# EasyEDA Pro project ProPrj_13cmPA-V1_V1_2025-12-29.epro

# Schematic 13cmPA-V1_V1
Board Name: 13cmPA-V1_V1; Create Date: 2025-12-21; Page Name: 13cmPA; Project Name: 13cmPA-V1_V1; Schematic Name: 13cmPA-V1_V1; Update Date: 2025-12-21; File: 13cmPA; Id: /; Sheet: /
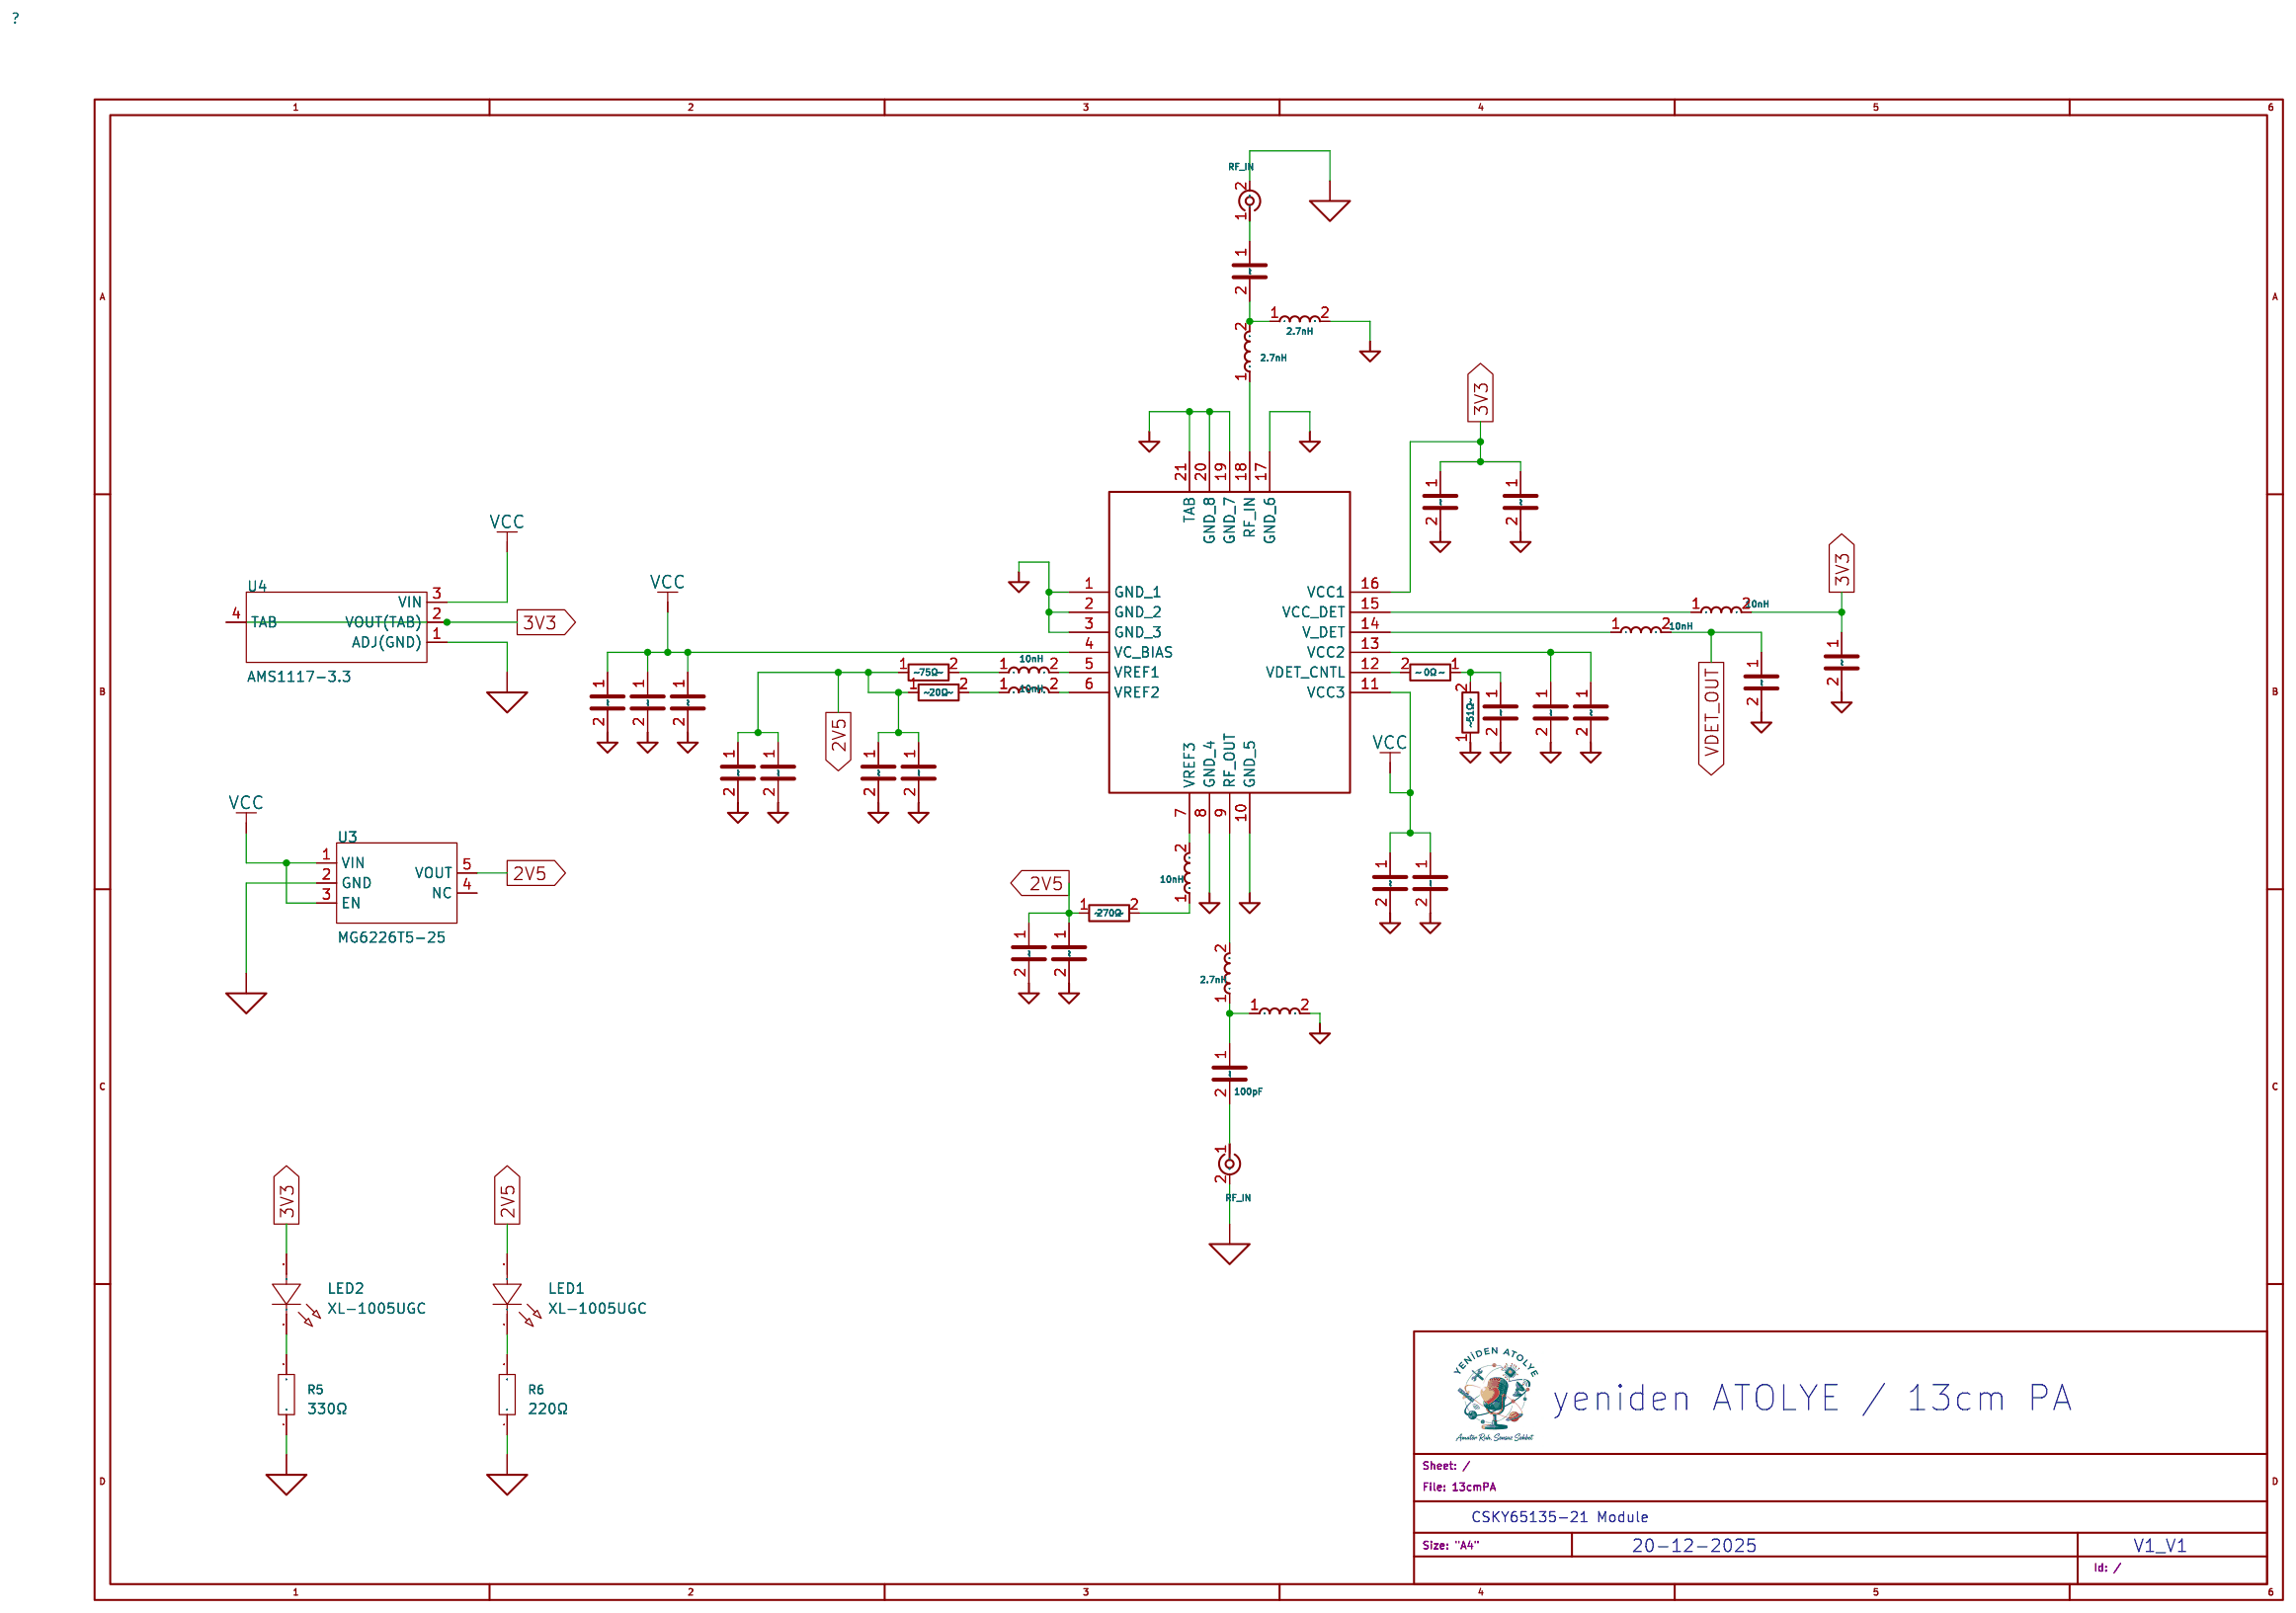
[diagram p0: schematic sheet]

## Parts
C1  8.2pF  [C0402]
C2  10uF  [C0805]
C3  100nF  [C0402]
C4  8.2pF  [C0402]
C5  100nF  [C0402]
C6  8.2pF  [C0402]
C7  10uF  [C0805]
C8  100nF  [C0402]
C9  100nF  [C0402]
C10  8.2pF  [C0402]
C11  3.3nF  [C0402]
C12  8.2pF  [C0402]
C13  8.2pF  [C0402]
C14  100nF  [C0402]
C15  270pF  [C0402]
C16  C0402A101J500NT  [C0402]
C17  10uF  [C0805]
C18  100pF  [C0805]
C19  100pF  [C0805]
C20  100nF  [C0402]
IC1  SKY65135-21  [QFN100P600X600X155-21M]
J1  RF_IN  [Connector_Coaxial:SMA_Amphenol_132289_EdgeMount]
J2  RF_IN  [Connector_Coaxial:SMA_Amphenol_132289_EdgeMount]
L1  10nH  [L0402-RD]
L2  10nH  [L0402-RD]
L3  2.7nH  [L0402-RD]
L4  2.7nH  [L0402-RD]
L5  2.7nH  [L0402-RD]
L6  2.7nH  [L0402-RD]
L7  10nH  [L0402-RD]
L8  10nH  [L0402-RD]
L9  10nH  [L0402-RD]
LED1  XL-1005UGC  [LED0402-RD_GREEN]
LED2  XL-1005UGC  [LED0402-RD_GREEN]
R1  75Ω  [R0402]
R2  20Ω  [R0402]
R3  0Ω  [R0402]
R4  51Ω  [R0402]
R5  330Ω  [R0402]
R6  220Ω  [R0402]
R7  270Ω  [R0402]
U3  MG6226T5-25  [SOT-23-5_L2.9-W1.6-P0.95-LS2.8-BL]
U4  AMS1117-3.3  [SOT-223-4_L6.5-W3.5-P2.30-LS7.0-BR]

## Library data of the parts
C1 C4 C6 C10 C12 C13 = 0402CG8R2C500NT: Capacitance:8.2pF Voltage Rating:50V Temperature Coefficient:C0G; LCSC Part Name: ±0.25pF 8.2pF 50V; Supplier Part: C1579; Manufacturer: FH(风华); Supplier Footprint: 0402; JLCPCB Part Class: Extended Part; Datasheet: https://item.szlcsc.com/datasheet/0402CG8R2C500NT/1931.html; Supplier: LCSC; Voltage Rating: 50V; Temperature Coefficient: C0G
C2 C7 C17 = C0805X106K010T: Capacitance:10uF Tolerance:±10% Tolerance:±10% Voltage Rating:10V Temperature Coefficient:X7R; LCSC Part Name: 10uF ±10% 10V; Supplier Part: C340314; Manufacturer: IHHEC(禾伸堂); Supplier Footprint: 0805; JLCPCB Part Class: Extended Part; Datasheet: https://item.szlcsc.com/datasheet/C0805X106K010T/317654.html; Supplier: LCSC; Tolerance: ±10%; Voltage Rating: 10V; Temperature Coefficient: X7R
C3 C5 C8 C9 C14 C20 = C0402X104K050T: Capacitance:100nF Tolerance:±10% Tolerance:±10% Voltage Rating:50V Temperature Coefficient:X7R; LCSC Part Name: 100nF ±10% 50V; Supplier Part: C501838; Manufacturer: IHHEC(禾伸堂); Supplier Footprint: 0402; JLCPCB Part Class: Extended Part; Datasheet: https://item.szlcsc.com/datasheet/C0402X104K050T/514597.html; Supplier: LCSC; Tolerance: ±10%; Voltage Rating: 50V; Temperature Coefficient: X7R
C11 = CC0402KRX7R9BB332: Capacitance:3.3nF Tolerance:±10% Tolerance:±10% Voltage Rating:50V Temperature Coefficient:X7R; LCSC Part Name: 3.3nF ±10% 50V; Supplier Part: C107028; Manufacturer: YAGEO(国巨); Supplier Footprint: 0402; JLCPCB Part Class: Extended Part; Datasheet: https://item.szlcsc.com/datasheet/CC0402KRX7R9BB332/108244.html; Supplier: LCSC; Tolerance: ±10%; Voltage Rating: 50V; Temperature Coefficient: X7R
C15 = CC0402KRX7R9BB271: Capacitance:270pF Tolerance:±10% Tolerance:±10% Voltage Rating:50V Temperature Coefficient:X7R; LCSC Part Name: 270pF ±10% 50V; Supplier Part: C107027; Manufacturer: YAGEO(国巨); Supplier Footprint: 0402; JLCPCB Part Class: Extended Part; Datasheet: https://item.szlcsc.com/datasheet/CC0402KRX7R9BB271/108243.html; Supplier: LCSC; Tolerance: ±10%; Voltage Rating: 50V; Temperature Coefficient: X7R
C16 = C0402A101J500NT: Supplier Part: C17702724; Manufacturer: TORCH(火炬); Supplier Footprint: 0402; JLCPCB Part Class: Extended Part; Datasheet: https://atta.szlcsc.com/upload/public/pdf/source/20230927/0E50D64F4D2F311F509CBC9B8B2C0B7B.pdf; Supplier: LCSC
C18 C19 = CL21C101JBANNNC: Capacitance:100pF Tolerance:±5% Tolerance:±5% Voltage Rating:50V Temperature Coefficient:C0G; LCSC Part Name: 100pF ±5% 50V; Supplier Part: C1790; Manufacturer: SAMSUNG(三星); Supplier Footprint: 0805; JLCPCB Part Class: Basic Part; Datasheet: https://item.szlcsc.com/datasheet/CL21C101JBANNNC/2142.html; Supplier: LCSC; Tolerance: ±5%; Voltage Rating: 50V; Temperature Coefficient: C0G
IC1 = SKY65135-21
J1 = Connector_Conn_Coaxial_Small: small coaxial connector (BNC, SMA, SMB, SMC, Cinch/RCA, LEMO, ...)
J2 = Connector_Conn_Coaxial_Small: small coaxial connector (BNC, SMA, SMB, SMC, Cinch/RCA, LEMO, ...); Attribute1: J1
L1 L2 L7-L9 = LQG15HS10NJ02D: Inductance:10nH Tolerance:±5% Tolerance:±5% Current Rating:500mA Current - Saturation (Isat):- DC Resistance(DCR):260mΩ Q @ Frequency:8@100MHz Frequency - Self Resonant:3.4GHz Ratings:-; LCSC Part Name: 10nH ±5%; Supplier Part: C77103; Manufacturer: muRata(村田); Supplier Footprint: 0402; JLCPCB Part Class: Extended Part; Datasheet: https://item.szlcsc.com/datasheet/LQG15HS10NJ02D/78230.html; Supplier: LCSC; Tolerance: ±5%; Current Rating: 500mA; DC Resistance(DCR): 260mΩ; Q @ Frequency: 8@100MHz; Frequency - Self Resonant: 3.4GHz
L3-L6 = MLG1005S2N7BT000: Inductance:2.7nH Tolerance:- Tolerance:- Current Rating:800mA Current - Saturation (Isat):- DC Resistance(DCR):80mΩ Q @ Frequency:7@100MHz Frequency - Self Resonant:6GHz Ratings:-; LCSC Part Name: ±0.1nH 2.7nH; Supplier Part: C275282; Manufacturer: TDK; Supplier Footprint: 0402; JLCPCB Part Class: Extended Part; Datasheet: https://item.szlcsc.com/datasheet/MLG1005S2N7BT000/263369.html; Supplier: LCSC; Current Rating: 800mA; DC Resistance(DCR): 80mΩ; Q @ Frequency: 7@100MHz; Frequency - Self Resonant: 6GHz
LED1 LED2 = XL-1005UGC_C965793: Illumination Color:Emerald Green Voltage - Forward(Vf):3V Voltage - Forward(Vf):3V Power(Watts):80mW Forward Current:25mA Wavelength - Dominant:516nm~531nm Wavelength - Dominant:516nm~531nm Peak Wavelength:531nm Lens Color:Water Clear Color Temperature:-; LCSC Part Name: 0402翠绿贴片式发光二极管; Supplier Part: C965793; Manufacturer: XINGLIGHT(成兴光); Supplier Footprint: 0402; JLCPCB Part Class: Extended Part; Datasheet: https://item.szlcsc.com/datasheet/XL-1005UGC/1051402.html; Supplier: LCSC; Illumination Color: Emerald Green; Voltage - Forward(Vf): 3V; Power(Watts): 80mW; Forward Current: 25mA; Wavelength - Dominant: 516nm~531nm; Peak Wavelength: 531nm; Lens Color: Water Clear; Luminous Intensity: 249mcd; Viewing Angle: 120°; Mounting Style: op View Mount; Operating Temperature: -40℃~+85℃
R1 = CR0402FF75R0G: Type:Thick Film Resistors Resistance: Tolerance:±1% Tolerance:±1% Power(Watts): Overload Voltage (Max): Temperature Coefficient:±200ppm/℃ Temperature Coefficient:±200ppm/℃ Operating Temperature Range:-55℃~+125℃ Operating Temperature Range:-55℃~+125℃; LCSC Part Name: 厚膜电阻 75Ω ±1% 62.5mW; Supplier Part: C100528; Manufacturer: LIZ(丽智电子); Supplier Footprint: 0402; JLCPCB Part Class: Extended Part; Datasheet: https://atta.szlcsc.com/upload/public/pdf/source/20180403/C189438_6D658388CC7843F35BBC9018D03F0B8E.pdf; Supplier: LCSC; Type: Thick Film Resistors; Tolerance: ±1%; Temperature Coefficient: ±200ppm/℃; Operating Temperature Range: -55℃~+125℃
R2 = CR0402FF20R0G: Type:Thick Film Resistors Resistance: Tolerance:±1% Tolerance:±1% Power(Watts): Overload Voltage (Max): Temperature Coefficient:±200ppm/℃ Temperature Coefficient:±200ppm/℃ Operating Temperature Range:-55℃~+125℃ Operating Temperature Range:-55℃~+125℃; LCSC Part Name: 厚膜电阻 20Ω ±1% 62.5mW; Supplier Part: C100299; Manufacturer: LIZ(丽智电子); Supplier Footprint: 0402; JLCPCB Part Class: Extended Part; Datasheet: https://atta.szlcsc.com/upload/public/pdf/source/20180403/C189438_6D658388CC7843F35BBC9018D03F0B8E.pdf; Supplier: LCSC; Type: Thick Film Resistors; Tolerance: ±1%; Temperature Coefficient: ±200ppm/℃; Operating Temperature Range: -55℃~+125℃
R3 = SCR0402J0R: Type:Thick Film Resistor Resistance:0Ω Tolerance:±5% Tolerance:±5% Power(Watts):62.5mW Voltage-Supply(Max):50V Operating Temperature:-55℃~+155℃ Operating Temperature:-55℃~+155℃; LCSC Part Name: 厚膜电阻 0Ω ±5% 62.5mW; Supplier Part: C3017451; Manufacturer: VO(翔胜); Supplier Footprint: 0402; JLCPCB Part Class: Extended Part; Datasheet: https://atta.szlcsc.com/upload/public/pdf/source/20220513/247AF9639BA21CF93567DC289CCC6A22.pdf; Supplier: LCSC; Type: Thick Film Resistor; Tolerance: ±5%; Power(Watts): 62.5mW; Voltage-Supply(Max): 50V; Operating Temperature: -55℃~+155℃
R4 = RC0402FR-0751RL: Type:Thick Film Resistor Resistance:51Ω Tolerance:±1% Tolerance:±1% Power(Watts):62.5mW Voltage-Supply(Max):50V Temperature Coefficient:±100ppm/℃ Temperature Coefficient:±100ppm/℃ Operating Temperature:-55℃~+155℃ Operating Temperature:-55℃~+155℃; LCSC Part Name: 厚膜电阻 51Ω ±1% 62.5mW; Supplier Part: C137960; Manufacturer: YAGEO(国巨); Supplier Footprint: 0402; JLCPCB Part Class: Extended Part; Datasheet: https://item.szlcsc.com/datasheet/RC0402FR-0751RL/149276.html; Supplier: LCSC; Type: Thick Film Resistor; Tolerance: ±1%; Power(Watts): 62.5mW; Voltage-Supply(Max): 50V; Temperature Coefficient: ±100ppm/℃; Operating Temperature: -55℃~+155℃
R5 = 0402WGF3300TCE: Type:Thick Film Resistors Resistance:330Ω Tolerance:±1% Tolerance:±1% Power(Watts):1/16W Voltage-Supply(Max):50V Temperature Coefficient:±100ppm/℃ Temperature Coefficient:±100ppm/℃ Operating Temperature:-55℃~+155℃ Operating Temperature:-55℃~+155℃; LCSC Part Name: 330Ω ±1% 62.5mW 厚膜电阻; Supplier Part: C25104; Manufacturer: UNI-ROYAL(厚声); Supplier Footprint: 0402; JLCPCB Part Class: Basic Part; Datasheet: https://item.szlcsc.com/datasheet/0402WGF3300TCE/25847.html; Supplier: LCSC; Type: Thick Film Resistors; Tolerance: ±1%; Power(Watts): 1/16W; Voltage-Supply(Max): 50V; Temperature Coefficient: ±100ppm/℃; Operating Temperature: -55℃~+155℃
R6 = 0402WGF2200TCE: Type:Thick Film Resistor Resistance:220Ω Tolerance:±1% Tolerance:±1% Power(Watts):62.5mW Voltage-Supply(Max):50V Temperature Coefficient:±100ppm/℃ Temperature Coefficient:±100ppm/℃ Operating Temperature:-55℃~+155℃ Operating Temperature:-55℃~+155℃; LCSC Part Name: 220Ω ±1% 62.5mW 厚膜电阻; Supplier Part: C25091; Manufacturer: UNI-ROYAL(厚声); Supplier Footprint: 0402; JLCPCB Part Class: Basic Part; Datasheet: https://item.szlcsc.com/datasheet/0402WGF2200TCE/25834.html; Supplier: LCSC; Type: Thick Film Resistor; Tolerance: ±1%; Power(Watts): 62.5mW; Voltage-Supply(Max): 50V; Temperature Coefficient: ±100ppm/℃; Operating Temperature: -55℃~+155℃
R7 = CR0402JF0271G: Type:Thick Film Resistors Resistance: Tolerance:±5% Tolerance:±5% Power(Watts): Overload Voltage (Max): Temperature Coefficient:±200ppm/℃ Temperature Coefficient:±200ppm/℃ Operating Temperature Range:-55℃~+125℃ Operating Temperature Range:-55℃~+125℃; LCSC Part Name: 厚膜电阻 270Ω ±5% 62.5mW; Supplier Part: C100627; Manufacturer: LIZ(丽智电子); Supplier Footprint: 0402; JLCPCB Part Class: Extended Part; Datasheet: https://atta.szlcsc.com/upload/public/pdf/source/20180403/C189438_6D658388CC7843F35BBC9018D03F0B8E.pdf; Supplier: LCSC; Type: Thick Film Resistors; Tolerance: ±5%; Temperature Coefficient: ±200ppm/℃; Operating Temperature Range: -55℃~+125℃
U3 = MG6226T5-25: Output Type:Fixed Voltage - Supply:5.5V Output Voltage:2.5V Output Voltage:2.5V Output Current:300mA Power Supply Rejection Ratio (PSRR):45dB@(1kHz) Voltage Dropout:500mV@(300mA) standby current:500nA Features:Over Current Protection；Short Circuit Protect; LCSC Part Name: 输入5.5V 输出2.5V 300mA; Supplier Part: C42411002; Manufacturer: Megain(美佳音); Supplier Footprint: SOT-23-5; Datasheet: https://item.szlcsc.com/datasheet/MG6226T5-25/44391804.html; Supplier: LCSC; Output Type: Fixed; Voltage - Supply: 5.5V; Output Voltage: 2.5V; Output Current: 300mA; Power Supply Rejection Ratio (PSRR): 45dB@(1kHz); Voltage Dropout: 500mV@(300mA); standby current: 500nA; Features: Over Current Protection；Short Circuit Protection；Thermal Shutdown; Operating Temperature: -40℃~+85℃@(Ta); Output Configuration: Positive; Number of Outputs: 1
U4 = AMS1117-3.3_C347222: Output Type:Fixed Voltage - Supply:12V Output Voltage:3.3V Output Voltage:3.3V Output Current:1A Power Supply Rejection Ratio (PSRR):60dB@(120Hz) Voltage Dropout:1.3V@(1A) standby current:5mA Noise:0.003%Vout Features:Over Current Protection Operating Tem; LCSC Part Name: 输出:3.3V 电流:1A 耐压:12V; Supplier Part: C347222; Manufacturer: UMW(友台半导体); Supplier Footprint: SOT-223; JLCPCB Part Class: Extended Part; Datasheet: https://item.szlcsc.com/datasheet/AMS1117-3.3/323882.html; Supplier: LCSC; Output Type: Fixed; Voltage - Supply: 12V; Output Voltage: 3.3V; Output Current: 1A; Power Supply Rejection Ratio (PSRR): 60dB@(120Hz); Voltage Dropout: 1.3V@(1A); standby current: 5mA; Noise: 0.003%Vout; Features: Over Current Protection; Operating Temperature: -40℃~+125℃; Output Configuration: Positive; Number of Outputs: 1

## Nets
2V5: C3.1 C4.1 C5.1 C6.1 C9.1 C10.1 LED1.2(A) R1.1 R2.1 R7.1 U3.5(VOUT)
3V3: C7.1 C8.1 C11.1 IC1.16(VCC1) L1.2 LED2.2(A) U4.2(VOUT(TAB)) U4.4(TAB)
GND: C1.2 C2.2 C3.2 C4.2 C5.2 C6.2 C7.2 C8.2 C9.2 C10.2 C11.2 C12.2 C13.2 C14.2 C15.2 C16.2 C17.2 C20.2 IC1.1(GND) IC1.2(GND) IC1.3(GND) IC1.8(GND_4) IC1.10(GND_5) IC1.17(GND_6) IC1.19(GND_7) IC1.20(GND_8) IC1.21(TAB) J1.2(Ext) J2.2(Ext) L4.2 L6.2 R4.1 R5.1 R6.1 U3.2(GND) U4.1(ADJ(GND))
VCC: C1.1 C2.1 C16.1 C17.1 C20.1 IC1.4(VC_BIAS) IC1.11(VCC3) U3.1(VIN) U3.3(EN) U4.3(VIN)
VDET_OUT: C12.1 L2.2
$1N4: C13.1 C14.1 IC1.13(VCC2)
$1N6: C15.1 R3.1 R4.2
$1N16: IC1.15(VCC_DET) L1.1
$1N17: IC1.12(VDET_CNTL) R3.2
$1N24: IC1.14(V_DET) L2.1
$1N3967: LED2.1(K) R5.2
$1N3984: LED1.1(K) R6.2
$1N4045: IC1.18(RF_IN) L3.1
$1N4072: C18.2 L3.2 L4.1
$1N4155: C19.1 L5.1 L6.1
$1N4158: IC1.9(RF_OUT) L5.2
$1N7293: IC1.7(VREF3) L7.2
$1N7297: L7.1 R7.2
$1N7421: IC1.6(VREF2) L9.2
$1N7425: IC1.5(VREF1) L8.2
$1N7430: L8.1 R1.2
$1N7435: L9.1 R2.2
Net-(C18-1): C18.1 J1.1(In)
Net-(C19-2): C19.2 J2.1(In)

Not connected (* = marked no-connect by the designer): U3 4(NC)

## Notes on the sheet
- yeniden ATOLYE / 13cm PA
- CSKY65135-21 Module
- 20-12-2025
- V1_V1

# Board 13cmPA-V1_V1
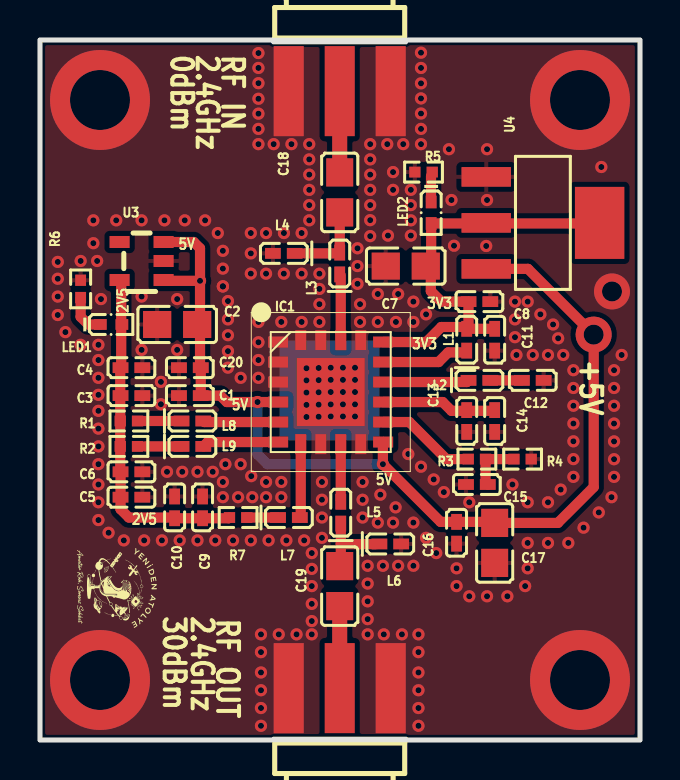
[diagram p1: board, top side]
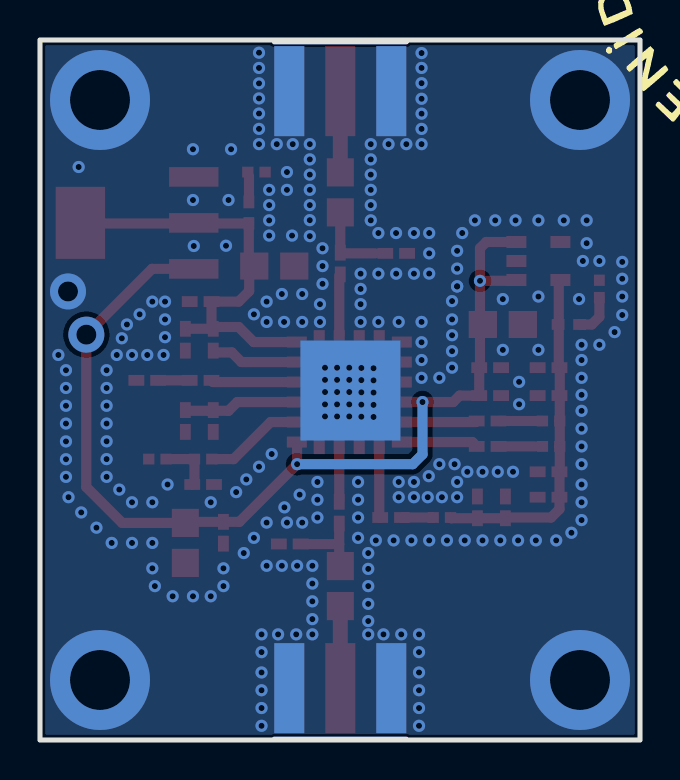
[diagram p2: board, bottom side, seen from below]

Outline 30 x 35 mm; copper layers: Top Layer, Bottom Layer. Coordinates in mm from the lower left corner of the outline.
Outline path: rectangle 0,35 30,0
Stack: Top Layer 0.035mm / Dielectric1 1.51mm FR4 er 4.5 / Bottom Layer 0.035mm

## Design rules (mm)
spacing safeClearance (default): track to track 0, other pairs 0 to 0.5
track width trackWidth (default): min 0.127, default 0.254, max 2.54
differential pair differentialPair (default): width min 0.127, default 0.254, max 2.54; gap min 0.152, default 0.152
via viaSize (default): diameter min 0.5, default 0.61, max 10; hole min 0.3, default 0.305, max 6

## Placement (name value [footprint] x y rotation side)
C1  8.2pF  [C0402]  7.49 17.22 180 top
C2  10uF  [C0805]  6.86 20.78 180 top
C3  100nF  [C0402]  4.57 17.22 0 top
C4  8.2pF  [C0402]  4.57 18.62 0 top
C5  100nF  [C0402]  4.57 12.14 0 top
C6  8.2pF  [C0402]  4.57 13.41 0 top
C7  10uF  [C0805]  18.29 23.7 180 top
C8  100nF  [C0402]  21.97 21.92 0 top
C9  100nF  [C0402]  8.13 11.63 90 top
C10  8.2pF  [C0402]  6.73 11.63 90 top
C11  3.3nF  [C0402]  22.73 20.01 270 top
C12  8.2pF  [C0402]  24.64 17.98 0 top
C13  8.2pF  [C0402]  21.34 15.95 270 top
C14  100nF  [C0402]  22.73 15.95 270 top
C15  270pF  [C0402]  21.84 12.78 180 top
C16  C0402A101J500NT  [C0402]  20.83 10.36 270 top
C17  10uF  [C0805]  22.73 9.85 270 top
C18  100pF  [C0805]  14.99 27.38 270 top
C19  100pF  [C0805]  14.99 7.7 270 top
C20  100nF  [C0402]  7.49 18.62 180 top
IC1  SKY65135-21  [QFN100P600X600X155-21M]  14.54 17.4 0 top
L1  10nH  [L0402-RD]  21.34 20.01 90 top
L2  10nH  [L0402-RD]  21.97 17.98 0 top
L3  2.7nH  [L0402-RD]  14.99 23.82 90 top
L4  2.7nH  [L0402-RD]  12.19 24.33 180 top
L5  2.7nH  [L0402-RD]  15.04 11.37 90 top
L6  2.7nH  [L0402-RD]  17.51 9.8 0 top
L7  10nH  [L0402-RD]  12.45 11.12 0 top
L8  10nH  [L0402-RD]  7.62 15.95 0 top
L9  10nH  [L0402-RD]  7.62 14.68 0 top
LED1  XL-1005UGC  [LED0402-RD_GREEN]  3.56 20.78 0 top
LED2  XL-1005UGC  [LED0402-RD_GREEN]  19.56 26.36 270 top
NOREF  -  [Pad_e1503]  14.48 17.47 90 top
R1  75Ω  [R0402]  4.45 15.95 0 top
R2  20Ω  [R0402]  4.45 14.68 0 top
R3  0Ω  [R0402]  21.84 14.05 180 top
R4  51Ω  [R0402]  24.13 14.05 180 top
R5  330Ω  [R0402]  19.18 28.4 0 top
R6  220Ω  [R0402]  2.03 22.55 270 top
R7  270Ω  [R0402]  9.91 11.12 0 top
SMA?  -  [SMA-SMD_BWSMA-KE-P001]  14.99 2.74 270 top
SMA?#2  -  [SMA-SMD_BWSMA-KE-P001#2]  14.99 32.21 90 top
U3  MG6226T5-25  [SOT-23-5_L2.9-W1.6-P0.95-LS2.8-BL]  5.08 23.95 90 top
U4  AMS1117-3.3  [SOT-223-4_L6.5-W3.5-P2.30-LS7.0-BR]  25.15 25.86 180 top

## Footprints (pads in the part's own frame, mm; a bottom-side part is the same pattern mirrored in y, then rotated)
C0402
  rect 0.79x0.54 smd: 1(-0.545,0) 2(0.545,0)
C0805
  rect 1.41x1.35 smd: 1(-1,0) 2(1,0)
L0402-RD
  rect 0.79x0.54 smd: 1(-0.545,0) 2(0.545,0)
LED0402-RD_GREEN
  rect 0.636x0.54 smd: 1(-0.538,0) 2(0.538,0)
Pad_e1503
  rect 5x5 smd far side: 1(0,0)
QFN100P600X600X155-21M
  rect 1x0.55 smd: 1(-2.63,2.5) 2(-2.63,1.5) 3(-2.63,0.5) 4(-2.63,-0.5) 5(-2.63,-1.5) 6(-2.63,-2.5) 11(2.62,-2.5) 12(2.62,-1.5) 13(2.62,-0.5) 14(2.62,0.5) 15(2.62,1.5) 16(2.62,2.5)
  rect 0.55x1 smd: 7(-1.5,-2.605) 8(-0.5,-2.605) 9(0.5,-2.605) 10(1.5,-2.605) 17(1.5,2.595) 18(0.5,2.595) 19(-0.5,2.595) 20(-1.5,2.595)
  rect 3.4x3.4 smd: 21(0,0)
R0402
  rect 0.566x0.54 smd: 1(-0.433,0) 2(0.433,0)
SMA-SMD_BWSMA-KE-P001
  rect 4.5x1.5 smd: 1(0.149,-2.55) 2(0.149,2.55) 5(0.149,0)
  rect 4.5x1.5 smd far side: 3(0.149,2.55) 4(0.149,-2.55)
SMA-SMD_BWSMA-KE-P001#2
  rect 4.5x1.5 smd: 1(0.237,-2.55) 2(0.237,2.55) 5(0.237,0)
  rect 4.5x1.5 smd far side: 3(0.237,2.55) 4(0.237,-2.55)
SOT-23-5_L2.9-W1.6-P0.95-LS2.8-BL
  rect 0.6x1 smd: 1(-0.95,-1.1) 2(0,-1.1) 3(0.95,-1.1) 4(0.95,1.1) 5(-0.95,1.1)
SOT-223-4_L6.5-W3.5-P2.30-LS7.0-BR
  rect 2.47x0.98 smd: 1(2.835,-2.3) 2(2.835,0) 3(2.835,2.3)
  rect 2.47x3.6 smd: 4(-2.835,0)

## Nets
As in the schematic, except:
GND: C1.2 C2.2 C3.2 C4.2 C5.2 C6.2 C7.2 C8.2 C9.2 C10.2 C11.2 C12.2 C13.2 C14.2 C15.2 C16.2 C17.2 C20.2 IC1.1 IC1.2 IC1.3 IC1.8 IC1.10 IC1.17 IC1.19 IC1.20 IC1.21 L4.2 L6.2 NOREF.1 R4.1 R5.1 R6.1 SMA?.1 SMA?.2 SMA?.3 SMA?.4 SMA?#2.1 SMA?#2.2 SMA?#2.3 SMA?#2.4 U3.2 U4.1
$1N4242: C19.2 SMA?.5

Pads without a net: SMA?#2 5; U3 4

## Via types
v1: diameter 1.8, hole 1, Top Layer to Bottom Layer, 2 vias
v2: diameter 0.61, hole 0.305, Top Layer to Bottom Layer, 267 vias
v3: diameter 5, hole 3, Top Layer to Bottom Layer, 4 vias

## Routing (per net, layer and track width the routed paths; a pad name or vN(x,y) marks a point on that pad's centre or on a via; arc(x,y) is an arc through that point)
2V5: length 16.8
  Top Layer w0.508: 6.73,11.12 4.45,11.12 4.03,11.54 4.03,11.89 ; C10.1 C9.1 9.44,11.09 R7.1 ; 4.06,22.91 4.06,18.78 4.01,18.73 4.01,13.42 C6.1 C5.1
3V3: length 21.2
  Top Layer w0.508: L1.2 C11.1 ; IC1.16 19.31,19.9 20.07,20.65 21.43,20.65 C8.1 20.07,21.92 19.54,22.44 19.54,24.2 19.56,24.22 LED2.2 27.7,25.83 27.73,25.86 U4.4
GND:
  vias: v1(28.6,22.43) v2(0.89,23.9) v2(0.89,23.06) v2(0.89,22.17) v2(0.89,21.25) v2(1.27,20.4) v2(2.03,23.95) v2(2.03,19.76) v2(2.67,25.98) v2(2.67,24.84) v2(2.86,23.95) v2(2.92,19.76) v2(2.92,19) v2(2.92,18.11) v2(2.92,17.26) v2(2.92,16.46) v2(2.92,15.57) v2(2.92,14.68) v2(2.92,13.79) v2(2.92,12.78) v2(2.92,11.89) v2(2.92,11) v2(3.05,22.05) v2(3.43,10.36) v2(3.81,25.98) v2(4.19,9.98) v2(5.08,25.98) v2(5.08,22.17) v2(5.08,19.51) v2(5.21,9.98) v2(6.05,17.91) v2(6.05,16.79) v2(6.1,9.98) v2(6.22,25.98) v2(6.35,13.41) v2(6.86,22.05) v2(6.86,19.51) v2(6.99,9.98) v2(7.11,13.41) v2(7.24,25.98) v2(7.87,13.41) v2(7.87,9.98) v2(8.26,25.98) v2(8.64,13.41) v2(8.76,9.98) v2(8.89,25.35) v2(9.14,24.46) v2(9.14,23.57) v2(9.14,22.68) v2(9.14,22.68) v2(9.14,12.9) v2(9.14,12.14) v2(9.27,13.79) v2(9.4,21.95) v2(9.4,21.03) v2(9.4,20.24) v2(9.4,19.44) v2(9.4,18.62) v2(9.65,9.98) v2(9.91,12.14) v2(10.03,18.11) v2(10.03,13.79) v2(10.54,25.35) v2(10.54,24.33) v2(10.54,23.32) v2(10.54,9.98) v2(10.56,13.19) v2(10.61,12.14) v2(10.92,34.35) v2(10.92,33.6) v2(10.92,32.84) v2(10.92,32.06) v2(10.92,31.32) v2(10.92,30.56) v2(10.92,29.79) v2(10.92,20.9) v2(10.92,19.89) v2(10.92,19) v2(10.92,18.11) v2(11.05,5.28) v2(11.05,4.39) v2(11.05,3.38) v2(11.05,2.49) v2(11.05,1.6) v2(11.05,0.71) v2(11.3,25.35) v2(11.3,23.32) v2(11.3,12.9) v2(11.3,12.14) v2(11.43,9.98) v2(11.68,29.79) v2(11.94,5.28) v2(12.06,20.9) v2(12.06,12.9) v2(12.06,12.14) v2(12.2,25.35) v2(12.19,23.32) v2(12.32,9.98) v2(12.57,29.79) v2(12.83,5.28) v2(13.08,25.35) v2(13.08,23.32) v2(13.08,20.9) v2(13.21,9.98) v2(13.32,18.59) v2(13.32,17.98) v2(13.32,17.37) v2(13.32,16.76) v2(13.32,16.15) v2(13.46,29.79) v2(13.46,29.03) v2(13.46,28.27) v2(13.46,27.51) v2(13.46,26.75) v2(13.46,25.98) v2(13.59,9.35) v2(13.59,8.56) v2(13.59,7.7) v2(13.59,6.81) v2(13.59,5.95) v2(13.59,5.28) v2(13.93,18.6) v2(13.93,17.99) v2(13.93,17.39) v2(13.93,16.77) v2(13.93,16.17) v2(13.97,23.32) v2(13.97,22.55) v2(13.97,21.79) v2(13.97,20.9) v2(14.1,12.9) v2(14.1,12.01) v2(14.1,11.12) v2(14.1,10.11) v2(14.54,18.61) v2(14.54,18.01) v2(14.54,17.4) v2(14.54,16.78) v2(14.54,16.18) v2(15.15,18.61) v2(15.15,18.01) v2(15.15,17.4) v2(15.15,16.78) v2(15.15,16.18) v2(15.75,18.61) v2(15.75,18.01) v2(15.75,17.4) v2(15.75,16.78) v2(15.75,16.18) v2(15.88,24.59) v2(15.88,23.7) v2(15.88,22.81) v2(16,21.79) v2(16,20.9) v2(16.13,12.9) v2(16.13,12.01) v2(16.13,11.12) v2(16.38,8.71) v2(16.38,7.82) v2(16.38,6.93) v2(16.38,6.04) v2(16.38,5.28) v2(16.51,29.79) v2(16.51,29.03) v2(16.51,28.27) v2(16.51,27.51) v2(16.51,26.75) v2(16.51,25.99) v2(16.51,25.19) v2(16.89,22.3) v2(16.89,20.9) v2(16.89,10.87) v2(17.02,12.27) v2(17.15,8.71) v2(17.19,5.28) v2(17.36,29.79) v2(17.4,25.22) v2(17.65,28.4) v2(17.65,27.51) v2(17.65,10.87) v2(17.8,20.9) v2(17.78,11.63) v2(17.91,22.3) v2(17.91,8.71) v2(18.1,5.28) v2(18.16,29.79) v2(18.42,14.3) v2(18.54,27.51) v2(18.54,26.75) v2(18.54,25.98) v2(18.54,25.22) v2(18.67,21.92) v2(18.67,20.9) v2(18.67,10.87) v2(18.67,8.71) v2(18.92,5.28) v2(18.92,4.39) v2(18.92,3.38) v2(18.92,2.49) v2(18.92,1.6) v2(18.92,0.71) v2(19.05,34.37) v2(19.05,33.6) v2(19.05,32.83) v2(19.05,32.08) v2(19.05,31.32) v2(19.05,30.56) v2(19.05,29.79) v2(19.05,13.66) v2(19.3,21.28) v2(19.3,10.11) v2(19.69,13.03) v2(19.81,9.35) v2(20.19,12.39) v2(20.45,29.54) v2(20.57,27) v2(20.7,24.71) v2(20.83,8.58) v2(20.83,7.7) v2(21.46,11.89) v2(21.46,7.19) v2(22.35,29.54) v2(22.35,27) v2(22.31,24.7) v2(22.35,7.19) v2(23.37,7.19) v2(23.62,12.78) v2(23.75,21.92) v2(23.75,21.03) v2(23.75,20.14) v2(23.82,19.25) v2(24.26,7.7) v2(24.38,21.92) v2(24.38,11.89) v2(24.38,9.85) v2(24.38,8.58) v2(24.64,19.25) v2(25.02,21.28) v2(25.4,19.25) v2(25.4,11.89) v2(25.4,9.85) v2(25.65,20.78) v2(25.91,20.09) v2(26.03,12.52) v2(26.16,19.25) v2(26.42,9.85) v2(26.67,18.49) v2(26.67,17.6) v2(26.67,16.71) v2(26.67,15.82) v2(26.67,14.93) v2(26.67,14.05) v2(26.67,13.16) v2(27.18,10.62) v2(27.94,11.38) v2(28.07,28.65) v2(28.58,12.14) v2(28.7,18.49) v2(28.7,17.6) v2(28.7,16.71) v2(28.7,15.82) v2(28.7,14.93) v2(28.7,14.04) v2(28.7,13.16) v2(29.08,19.25) v3(3,32) v3(3,3) v3(27,32) v3(27,3)
VCC: length 52.2
  Top Layer w0.508: IC1.4 v2(10.88,16.9) 9.34,16.9 9.02,17.22 C1.1 8.04,18.49 8,18.53 v2(8,22.96) ; v2(8,22.96) 6.22,22.96 U3.1 ; v2(8,22.96) 8,24.59 7.69,24.9 U3.3 ; U4.3 24.4,23.56 27.69,20.27 27.69,12.65 25.89,10.85 C17.1 22.68,10.91 C16.1 20.03,10.91 v2(17.15,13.79) 17.15,14.89 IC1.11
  Bottom Layer w0.508: v2(10.88,16.9) 10.88,14.28 11.37,13.79 v2(17.15,13.79)
  vias: v1(27.68,20.27)
VDET_OUT: length 1.6
  Top Layer w0.508: L2.2 C12.1
$1N4: length 5.8
  Top Layer w0.508: C14.1 22.7,16.46 20.57,16.46 20.13,16.9 IC1.13
$1N6: length 2.5
  Top Layer w0.508: C15.1 22.28,12.89 R3.1 23.44,14.05
$1N16: length 3.9
  Top Layer w0.508: L1.1 21.25,19.38 20.41,19.38 19.93,18.9 17.69,18.9
$1N17: length 4.8
  Top Layer w0.508: IC1.12 18.47,15.9 20.32,14.05 21.16,14.05
$1N24: length 3.8
  Top Layer w0.508: L2.1 21.34,17.9 17.69,17.9
$1N3967: length 1.3
  Top Layer w0.508: 19.55,28.19 19.55,26.9
$1N3984: length 2.1
  Top Layer w0.508: LED1.1 2.41,20.78 2.03,21.16 R6.2
$1N4045: length 2.9
  Top Layer w0.508: 15.04,20.3 15.04,23.23
$1N4072: length 3.7
  Top Layer w0.508: 14.86,26.25 14.99,26.13 L3.2 14.95,24.33 13.25,24.33
$1N4155: length 3.6
  Top Layer w0.508: 15.04,8.75 15.04,9.79 ; 15.04,9.79 16.79,9.79 ; 15.04,9.79 15.04,10.63
$1N4158: length 2.5
  Top Layer w0.508: 15.04,14.5 15.04,11.97
$1N4242: length 4.1
  Top Layer w0.75: C19.2 SMA?.5
$1N5118: length 4.2
  Top Layer w0.75: 14.99,28.51 14.99,32.71
$1N7293: length 3.7
  Top Layer w0.508: L7.2 13.04,11.17 IC1.7
$1N7297: length 1.6
  Top Layer w0.508: R7.2 L7.1
$1N7421: length 3.3
  Top Layer w0.508: 11.39,14.9 8.38,14.9 L9.2
$1N7425: length 3.2
  Top Layer w0.508: L8.2 8.22,15.9 11.39,15.9
$1N7430: length 2.2
  Top Layer w0.508: R1.2 L8.1
$1N7435: length 1.8
  Top Layer w0.508: 5.26,14.68 L9.1

## Copper pours and planes (outline as drawn; the poured copper is in the pictures)
GND on Top Layer: -1.65,49.22 35.94,49.22 35.94,-13.01 -1.65,-13.01
GND on Bottom Layer: -7.11,49.73 35.31,49.73 35.31,-15.93 -7.11,-15.93

## Text on the board
Top Solder Mask Layer: yeniden ATOLYE 2025
Top Silkscreen Layer: 3V3 | 2V5 | 5V | 30dBm | 0dBm | 2.4GHz | RF OUT | RF IN | +5V
